# Altium schematic sheet USB_OTG_FS.SchDoc
size A4; Revision: B.2(PCB.SCH)
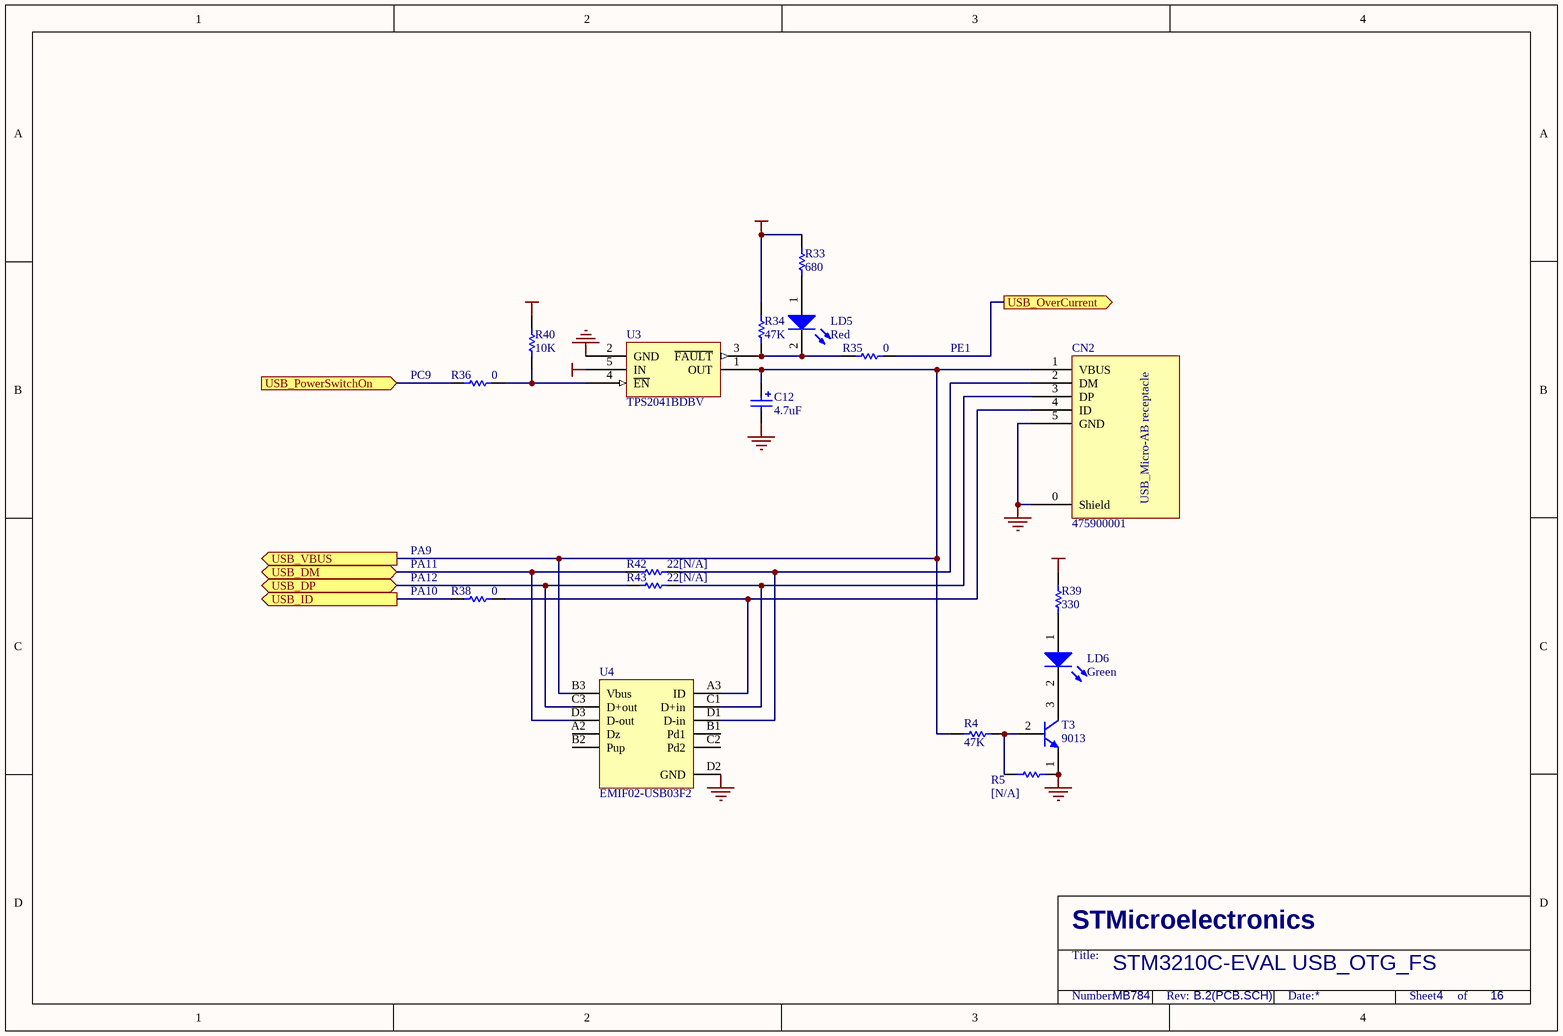
[diagram p0: USB_OTG_FS.SchDoc]

## Parts
C12  4.7uF  [TAN-A]
CN2  475900001  [USB-MICRO-AB]
LD5  Red  [0603D]
LD6  Green  [0603D]
R4  47K  [0603R]
R5  [N/A]  [0603R]
R33  680  [0603R]
R34  47K  [0603R]
R35  0  [0603R]
R36  0  [0603R]
R38  0  [0603R]
R39  330  [0603R]
R40  10K  [0603R]
R42  22[N/A]  [0603R]
R43  22[N/A]  [0603R]
T3  9013  [SOT-23]
U3  TPS2041BDBV  [SOT-23-5L]
U4  EMIF02-USB03F2  [FlipChip(11)]

## Ports
USB_DM (bidir), USB_DP (bidir), USB_ID (out), USB_OverCurrent (out), USB_PowerSwitchOn (in), USB_VBUS (out)

## Nets
+3V3: R33.2 R34.1 R39.2 R40.1
+5V: U3.5(IN)
GND: C12.2 CN2.0(Shield) CN2.5(GND) R5.1 T3.1(E) U3.2(GND) U4.D2(GND)
USB_DM: R42.2 U4.D3(D-out) ; port USB_DM
USB_DP: R43.2 U4.C3(D+out) ; port USB_DP
USB_ID: R38.2 ; port USB_ID
USB_OverCurrent: R35.1 ; port USB_OverCurrent
USB_PowerSwitchOn: R36.2 ; port USB_PowerSwitchOn
USB_VBUS: C12.1 CN2.1(VBUS) R4.2 U3.1(OUT) U4.B3(Vbus) ; port USB_VBUS
NetCN2_2: CN2.2(DM) R42.1 U4.D1(D-in)
NetCN2_3: CN2.3(DP) R43.1 U4.C1(D+in)
NetCN2_4: CN2.4(ID) R38.1 U4.A3(ID)
NetLD5_1: LD5.1(A) R33.1
NetLD5_2: LD5.2(K) R34.2 R35.2 U3.3(~{FAULT})
NetLD6_1: LD6.1(A) R39.1
NetLD6_2: LD6.2(K) T3.3(C)
NetR4_1: R4.1 R5.2 T3.2(B)
NetR36_1: R36.1 R40.2 U3.4(~{EN})

Not connected (* = marked no-connect by the designer): U4 A2(Dz) B1(Pd1) B2(Pup) C2(Pd2)

## Notes on the sheet
- (near R36) PC9
- PE1
- PA9
- (near R38) PA11
- (near R38) PA12
- (near R38) PA10
- STM3210C-EVAL USB_OTG_FS
- MB784
- 4
- 16
- STMicroelectronics
- Title:
- Number:
- Rev:
- Date:
- Sheet       of
- (in symbol 475900001) USB_Micro-AB receptacle

## Library data of the parts
C12 = Cap Pol1: Polarized Capacitor (Radial); Value: 47uF; Published: 8-Jun-2000; Revision: July-2002: Re-released for DXP Platform.; Publisher: Altium Limited
LD5 LD6 = LED2: Typical RED, GREEN, YELLOW, AMBER GaAs LED; Published: 8-Jun-2000; Revision: July-2002: Re-released for DXP Platform.; Publisher: Altium Limited
R4 R5 R34 R39 R40 = res1: Resistor; Value: 1K; Published: 8-Jun-2000; Revision: July-2002: Re-released for DXP Platform.; Publisher: Altium Limited
R33 R35 R36 R38 R42 R43 = Res1: Resistor; Value: 1K; Published: 8-Jun-2000; Revision: July-2002: Re-released for DXP Platform.; Publisher: Altium Limited
T3 = NPN: NPN Bipolar Transistor; Code - JEDEC: TO-226-AA; Published: 8-Jun-2000; Revision: July-2002: Re-released for DXP Platform.; Publisher: Altium Limited
U3 = STMPS2141STR